# Altium schematic sheet G-103P-P-20190703(wifi).SchDoc
size A4
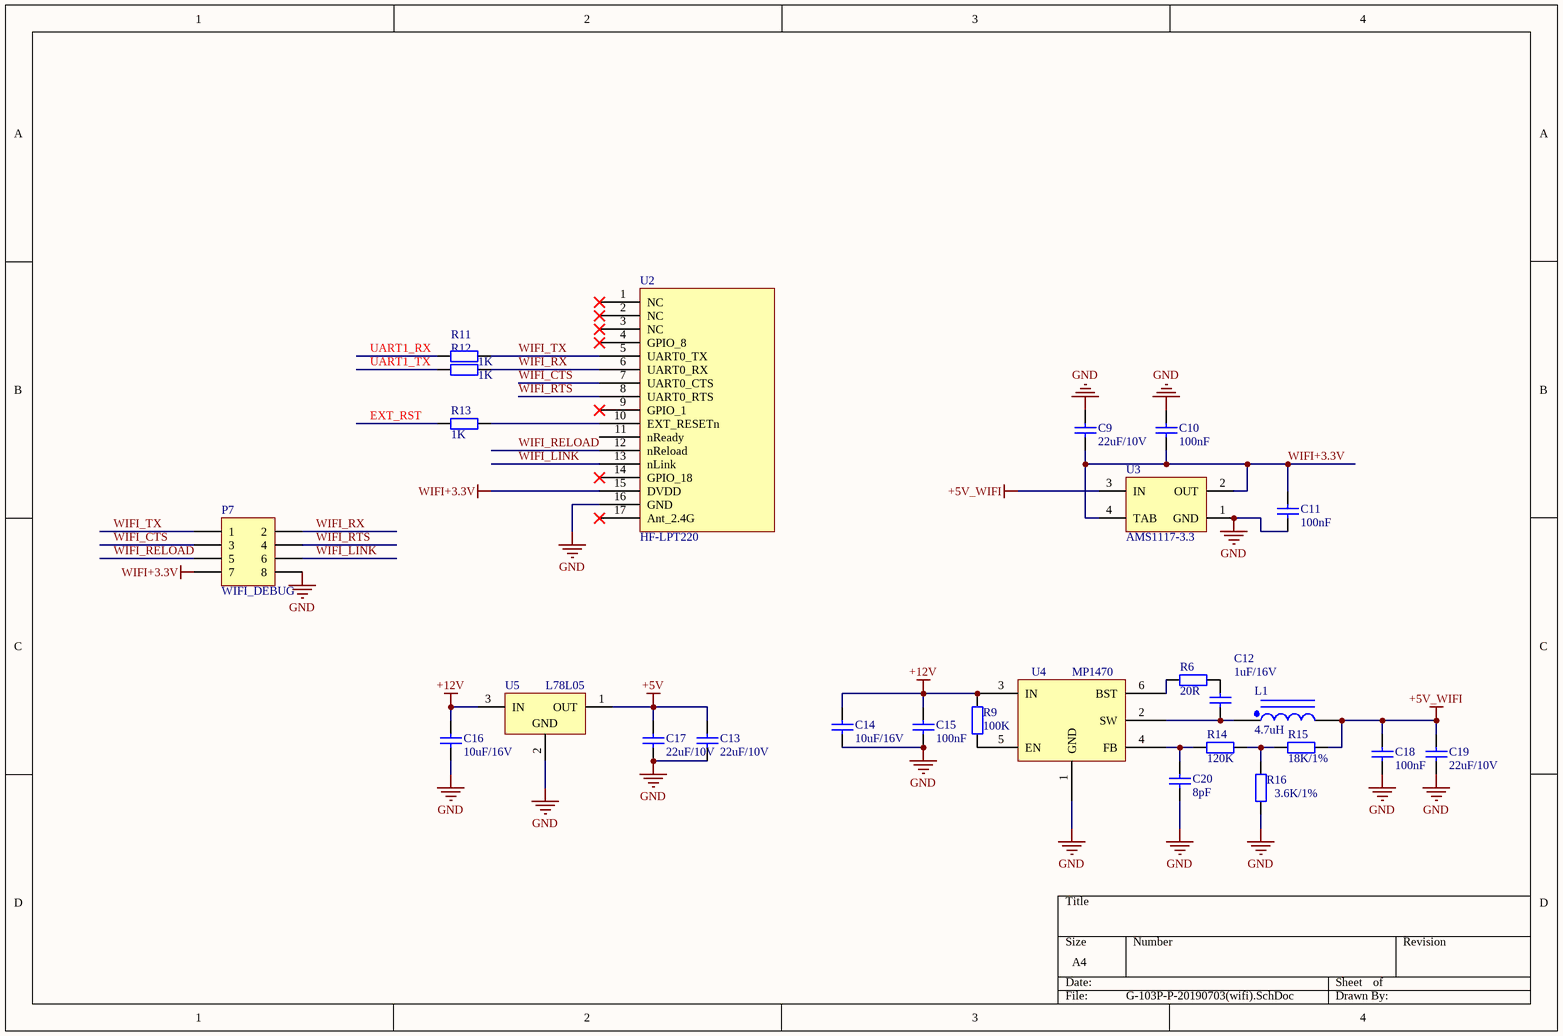
[diagram p0: G-103P-P-20190703(wifi).SchDoc]

## Parts
C9  22uF/10V  [SMD-0603]
C10  100nF  [SMD-0603]
C11  100nF  [SMD-0603]
C12  1uF/16V  [SMD-0603]
C13  22uF/10V  [SMD-0603]
C14  10uF/16V  [SMD-0603]
C15  100nF  [SMD-0603]
C16  10uF/16V  [SMD-0603]
C17  22uF/10V  [SMD-0603]
C18  100nF  [SMD-0603]
C19  22uF/10V  [SMD-0603]
C20  8pF  [SMD-0603]
L1  4.7uH  [NR3010]
P7  WIFI_DEBUG  [HDR2X4]
R6  20R  [SMD-0603]
R9  100K  [SMD-0603]
R11  1K  [SMD-0603]
R12  1K  [SMD-0603]
R13  1K  [SMD-0603]
R14  120K  [SMD-0603]
R15  18K/1%  [SMD-0603]
R16  3.6K/1%  [SMD-0603]
U2  HF-LPT220  [HF-LPT220]
U3  AMS1117-3.3  [SOT223]
U4  MP1470  [SOT23-6A]
U5  L78L05  [SOT89]

## Nets
+5V: C13.1 C17.1 U5.1(OUT)
+5V_WIFI: C18.1 C19.1 L1.2 R15.2 U3.3(IN)
+12V: C14.1 C15.1 C16.1 R9.2 U4.3(IN) U5.3(IN)
GND: C9.1 C10.2 C11.2 C13.2 C14.2 C15.2 C16.2 C17.2 C18.2 C19.2 C20.1 P7.8 R16.1 U2.16(GND) U3.1(GND) U4.1(GND) U5.2(GND)
WIFI+3.3V: C9.2 C10.1 C11.1 P7.7 U2.15(DVDD) U3.2(OUT) U3.4(TAB)
EXT_RST: R13.2
UART1_RX: R11.2
UART1_TX: R12.2
WIFI_CTS: P7.3 U2.7(UART0_CTS)
WIFI_LINK: P7.6 U2.13(nLink)
WIFI_RELOAD: P7.5 U2.12(nReload)
WIFI_RTS: P7.4 U2.8(UART0_RTS)
WIFI_RX: P7.2 R12.1 U2.6(UART0_RX)
WIFI_TX: P7.1 R11.1 U2.5(UART0_TX)
NetC12_1: C12.1 L1.1 U4.2(SW)
NetC12_2: C12.2 R6.1
NetC20_2: C20.2 R14.2 U4.4(FB)
NetR6_2: R6.2 U4.6(BST)
NetR9_1: R9.1 U4.5(EN)
NetR13_1: R13.1 U2.10(EXT_RESETn)
NetR14_1: R14.1 R15.1 R16.2

Not connected (* = marked no-connect by the designer): U2 1(NC)* 2(NC)* 3(NC)* 4(GPIO_8)* 9(GPIO_1)* 11(nReady) 14(GPIO_18)* 17(Ant_2.4G)*

## Library data of the parts
C9-C11 = Cap: Capacitor
  C10 C11: Published: 8-Jun-2000; LatestRevisionDate: 17-Jul-2002; LatestRevisionNote: Re-released for DXP Platform.; PackageReference: RAD-0.3; Publisher: Altium Limited; Value: 100nF
C12 C13 C15 C17-C20 = SMDCAP: 贴片电容
C14 C16 = Cap: Capacitor; Value: 100nF; Published: 8-Jun-2000; LatestRevisionDate: 17-Jul-2002; LatestRevisionNote: Re-released for DXP Platform.; PackageReference: RAD-0.3; Publisher: Altium Limited
L1 = Inductor Iron Dot: 贴片电感
P7 = Header 4X2: Header, 4-Pin, Dual row; LatestRevisionDate: 17-Jul-2002; LatestRevisionNote: Re-released for DXP Platform.; Publisher: Altium Limited
R6 R9 R14-R16 = SMDRES: 贴片电阻
R11-R13 = Res2: Resistor; Published: 8-Jun-2000; LatestRevisionDate: 17-Jul-2002; LatestRevisionNote: Re-released for DXP Platform.; PackageReference: AXIAL-0.4; Publisher: Altium Limited; Value: 1K
U3 = LM1117IMP-3.3: 800mA Low-Dropout Linear Regulator; Manufacturer: National Semiconductor; CompType: LDO IC; PackageTopMarking: XYTT*N05B; PowerWise: N; Published: 4-Dec-2008; DatasheetVersion: Apr-2006; PackageVersion: revB, Apr-2003; PackageReference: MP04A; Publisher: Altium Limited; PackageDescription: Molded SOT-223, 6.50 x 3.56 x 1.6mm Body, 4 Lead, 2.3mm Pitch; PartNumber: LM1117IMP-3.3; RoHS: O; PinCount: 4; DigiKeyPartNumber: LM1117IMP-3.3CT-ND; Code_JEDEC: TO-261-AA; Code_IPC: SOT223-4; ComponentLink1Description: LM1117 Datasheet; ComponentLink1URL: http://www.national.com/ds/LM/LM1117.pdf; ComponentLink2Description: LM1117 Web Page; ComponentLink2URL: http://www.national.com/pf/LM/LM1117.html; ComponentLink3Description: MP04A Package Page; ComponentLink3URL: http://www.national.com/packaging/folders/mp04a.html
U4 = MP1470: DCDC降压芯片
U5 = L78L05CZ: Positive Voltage Regulator; Published: 24-Aug-2001; LatestRevisionDate: 17-Jul-2002; LatestRevisionNote: Re-released for DXP Platform.; DatasheetVersion: Feb-1999; PackageReference: TO92; Publisher: Altium Limited; PackageDescription: TO, Flat Index; 3 In-Line, Axial Leads; Body Dia. 4.8mm; Leads 0.51 x 0.51 mm (max); ComponentLink1Description: Manufacturer Link; ComponentLink1URL: http://www.st.com/